# Altium project Segger J-Link Cortex Adapter Board.PrjPcb
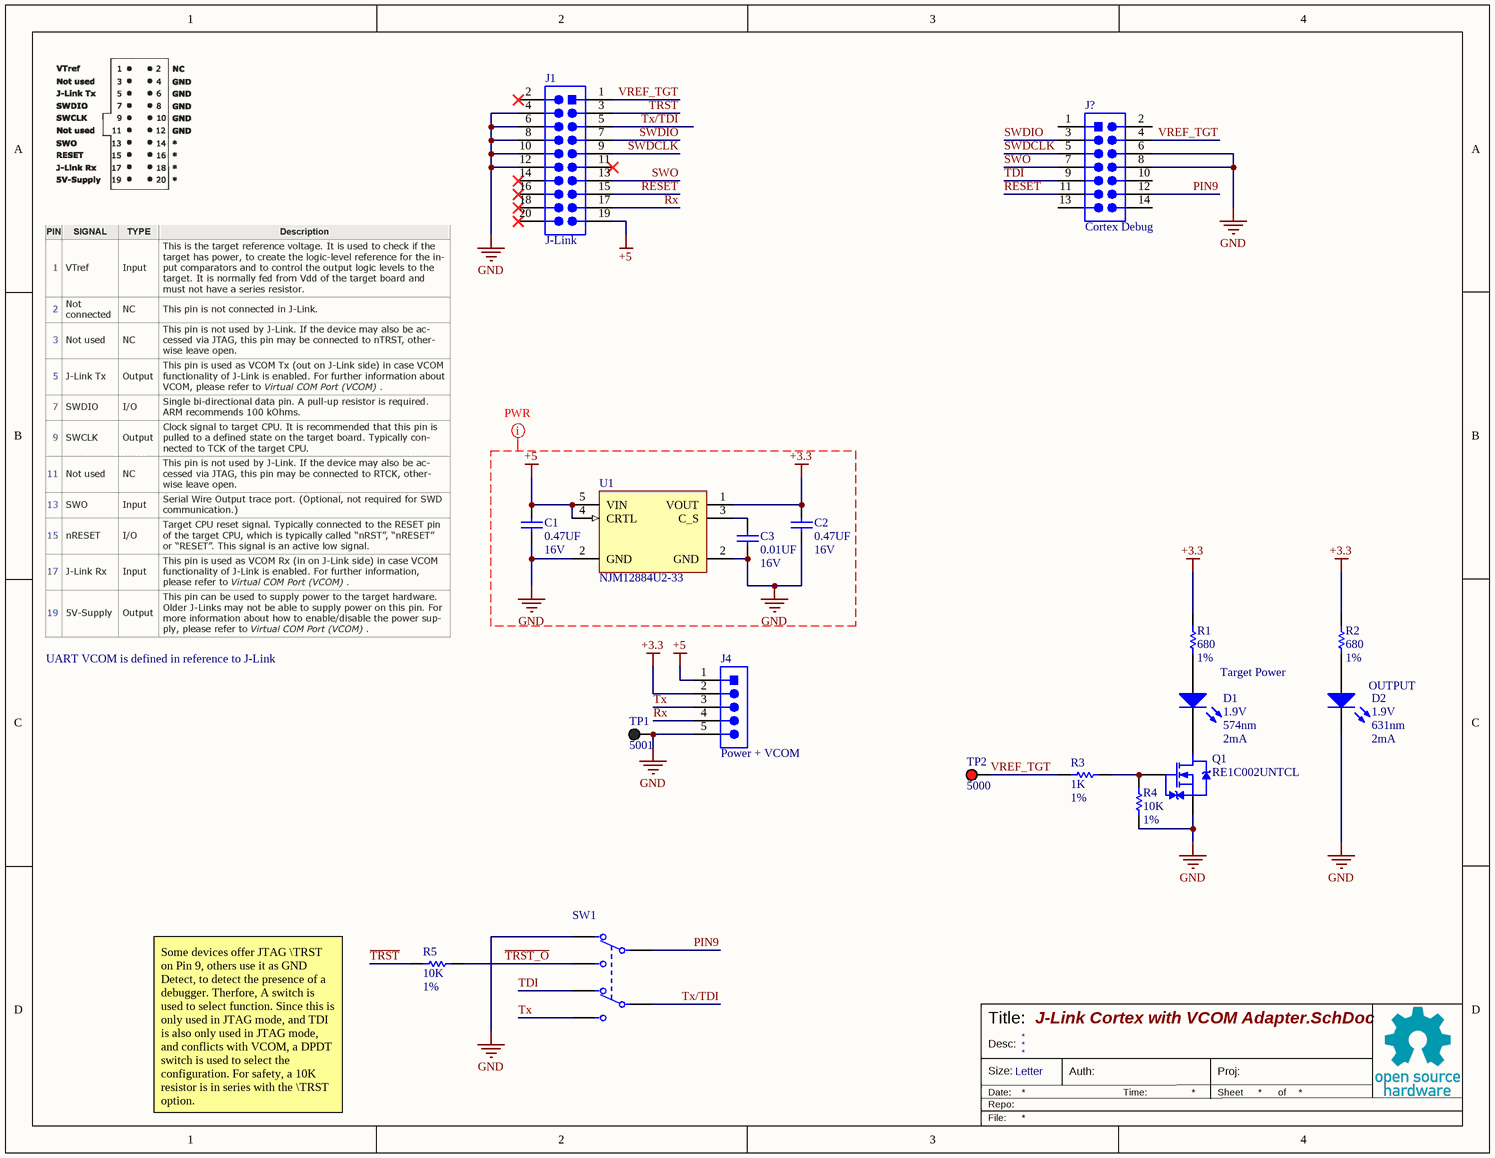
[diagram p0: J-Link Cortex with VCOM Adapter.SchDoc]
Version: v1.0; VerDate: 5/31/2020; ProjShrtName: J-Link Cortex + VCOM; ProjGitURL: https://github.com/aakatz3/J-Link-Cortex-VCOM; ProjAuth: Andrew Katz
1 sheet, 18 parts. Net scope: global (net labels, ports and power ports of the same name join across sheets).
Board file: J-Link Cortex with VCOM Adapter.PcbDoc

## Sheet J-Link Cortex with VCOM Adapter.SchDoc
size Letter; Engineer: Andrew Katz; Address4: USA; GithubURL: https://github.com/aakatz3/J-Link-Cortex-VCOM; ProjShort: J-Link Cortex + VCOM

### Parts
C1  Val: 0.47UF  Vol: 16V  [0603_CAP]  (hidden comment: CAP 0603 0.47UF 16V 10% X7R)
C2  Val: 0.47UF  Vol: 16V  [0603_CAP]  (hidden comment: CAP 0603 0.47UF 16V 10% X7R)
C3  Val: 0.01UF  Vol: 16V  [0603_CAP]  (hidden comment: CAP 0603 0.01UF 16V 10% X7R)
D1  Voltage Rating: 1.9V  Wavelength: 574nm  Test Current: 2mA  [SM0805GCL]  (hidden comment: Green LED)
D2  Voltage Rating: 1.9V  Wavelength: 631nm  Test Current: 2mA  [SM0805HCL]  (hidden comment: Red LED)
J1  20 contact Female header, RA  [SFH11-PBPC-D10-RA-BK]  (value not drawn)
J4  5 contacts Male header  [70543-0109 - slim]  (value not drawn)
J?  STDC14 Debug Connector  [FTSH-107-01-F-DV-K]  (value not drawn)
Q1  Manufacturer P/N: RE1C002UNTCL  [SC89]  (hidden comment: N-Channel MOSFET)
R1  Val: 680  Tol: 1%  [0603_RES]  (hidden comment: RES 0603 680 1%)
R2  Val: 680  Tol: 1%  [0603_RES]  (hidden comment: RES 0603 680 1%)
R3  Val: 1K  Tol: 1%  [0603_RES]  (hidden comment: RES 0603 1K 1%)
R4  Val: 10K  Tol: 1%  [0603_RES]  (hidden comment: RES 0603 10K 1%)
R5  Val: 10K  Tol: 1%  [0603_RES]  (hidden comment: RES 0603 10K 1%)
SW1  SWITCH SLIDE DPDT 300MA 6V  [JS202011CQN]  (value not drawn)
TP1  5001  [KSTN-5001]
TP2  5000  [KSTN-5000]
U1  P/N: NJM12884U2-33  [SOT89-5_NJR]  (hidden comment: 3.3V LDO Soft start reverse current reverse voltage)

### Nets
+3.3: C2.2 J4.2 R1.2 R2.2 U1.1(VOUT)
+5: C1.2 J1.19 J4.1 U1.4(CRTL) U1.5(VIN)
GND: C1.1 C2.1 C3.1 D2.K J1.4 J1.6 J1.8 J1.10 J1.12 J4.5 J?.6(SWDCLK/TCK) J?.8(SWO/TDO) Q1.2(S) R4.1 SW1.1 TP1.1 U1.2(GND)
~{RESET}: J1.15 J?.11(GNDDetect)
~{TRST}: J1.3 R5.1
~{TRST_O}: R5.2 SW1.3
PIN9: J?.12(~{RESET}) SW1.2
Rx: J1.17 J4.4
SWDCLK: J1.9 J?.5(GND)
SWDIO: J1.7 J?.3(VCC)
SWO: J1.13 J?.7(GND)
TDI: J?.9(RCLK) SW1.4
Tx: J4.3 SW1.6
Tx/TDI: J1.5 SW1.5
VREF_TGT: J1.1 J?.4(SWDIO/TMS) R3.1 TP2.1
NetC3_2: C3.2 U1.3(C_S)
NetD1_A: D1.A R1.1
NetD1_K: D1.K Q1.3(D)
NetD2_A: D2.A R2.1
NetQ1_1: Q1.1(G) R3.2 R4.2

Not connected (* = marked no-connect by the designer): J1 2* 11* 14* 16* 18* 20*; J? 1(Reserved) 2(Reserved) 10(NC/TDI) 13(TxD) 14(RxD)

### Layout directives
net class PWR: +3.3, +5, GND

### Notes on the sheet
- (near J?) Cortex Debug
- (near J1) J-Link
- UART VCOM is defined in reference to J-Link
- Target Power
- OUTPUT
- (near J4) Power + VCOM
- Some devices offer JTAG \TRST on Pin 9, others use it as GND Detect, to detect the presence of a debugger. Therfore, A switch is used to select function. Since this is only used in JTAG mode, and TDI is also only used in JTAG mode, and conflicts with VCOM, a DPDT switch is used to select the configuration. For safety, a 10K resistor is in series with the \TRST option.
- Title:
- Desc:
- Size:
- Date:
- File:
- Repo:
- Letter
- Auth:
- Time:
- Sheet
- Proj:
- of

### Library data of the parts
C1 C2 = CAP 0603 0.47UF 16V 10% X7R: Capacitor Surface Mount 0603 Footprint 0.47UF 16V 10% Tolerance Ceramic X7R; Manufacturer: Various; PCB Package: 0603; Description in Visual: Cap SMT 0603 0.47UF 16V 10%  Cer X7R; P/N: CAP 0603 0.47UF 16V 10% X7R; Manufacturer P/N: Various; Value: 0.47UF; Voltage: 16V; Tolerance: 10%; Type: Ceramic X7R; ComponentLink1Description: Manufacturer Website; ComponentLink2Description: Component Datasheet; ComponentLink3Description: Octopart Link
C3 = CAP 0603 0.01UF 16V 10% X7R: Capacitor Surface Mount 0603 Footprint 0.01UF 16V 10% Tolerance Ceramic X7R; Manufacturer: Various; PCB Package: 0603; Description in Visual: Cap SMT 0603 0.01UF 16V 10%  Cer X7R; P/N: CAP 0603 0.01UF 16V 10% X7R; Manufacturer P/N: Various; Value: 0.01UF; Voltage: 16V; Tolerance: 10%; Type: Ceramic X7R; ComponentLink1Description: Manufacturer Website; ComponentLink2Description: Component Datasheet; ComponentLink3Description: Octopart Link
D1 = SM0805GCL: Green 574nm LED Indication - Discrete 1.9V 0805 (2012 Metric); Manufacturer: Bivar; PCB Package: 0805; Configuration: Single; Lens Style: Square; Millicandela Rating: 3.6mcd; Viewing Angle: 130°; Lens Type: Clear; Package Class: Surface Mount; P/N: SM0805GCL; Manufacturer P/N: SM0805GCL; Description in Visual: Green 574nm LED Indication - Discrete 1.9V 0805 (2012 Metric); Color: Green; ComponentLink1Description: Manufacturer Website; ComponentLink1URL: #https://www.bivar.com/#; ComponentLink2Description: Component Datasheet; ComponentLink2URL: https://www.bivar.com/parts_content/Datasheets/SM0805HCL.pdf; ComponentLink3Description: Octopart Link; ComponentLink3URL: #https://octopart.com/sm0805gcl-bivar-22059573?r=sp#
D2 = SM0805HCL: Red 631nm LED Indication - Discrete 1.9V 0805 (2012 Metric); Manufacturer: Bivar; PCB Package: 0805; Configuration: Single; Lens Style: Square; Millicandela Rating: 11.5mcd; Viewing Angle: 130°; Lens Type: Clear; Package Class: Surface Mount; P/N: SM0805HCL; Manufacturer P/N: SM0805HCL; Description in Visual: Red 631nm LED Indication - Discrete 1.9V 0805 (2012 Metric); Color: Red; ComponentLink1Description: Manufacturer Website; ComponentLink1URL: #https://www.bivar.com/#; ComponentLink2Description: Component Datasheet; ComponentLink2URL: https://www.bivar.com/parts_content/Datasheets/SM0805HCL.pdf; ComponentLink3Description: Octopart Link; ComponentLink3URL: #https://octopart.com/sm0805hcl-bivar-2191581?r=sp#
J1 = SFH11-PBPC-D10-RA-BK: 20 Position Header Connector  Through Hole, Right Angle; Manufacturer: Sullins; PCB Package: 2x10 THT; Description in Visual: Con Hdr Female 20 contacts horizontal 2X10 keyed; Number of Contacts: 20; Pitch: 0.100"; P/N: SFH11-PBPC-D10-RA-BK; Manufacturer P/N: SFH11-PBPC-D10-RA-BK; Orientation: horizontal; Number of Rows: 2; ComponentLink1Description: Manufacturer Website; ComponentLink1URL: https://www.sullinscorp.com/; ComponentLink2Description: Component Datasheet; ComponentLink2URL: https://datasheet.ciiva.com/754/sfh11-pxxc-dxx-ra-xx11161-c-754566.pdf?src-supplier=Digi-Key; Supplier 1: Digi-Key; Supplier Part Number 1: S9205-ND
J4 = 70543-0109: Connector Male Header 1X5 vertical 5contacts 0.100in pitch 0.76um Gold finish shrouded with latch; Manufacturer: Molex; PCB Package: NON-STD TH; Description in Visual: Con Hdr Male 5contacts vertical 1X5; Number of Contacts: 5; P/N: 70543-0109; Manufacturer P/N: 70543-0109; Orientation: vertical; Number of Rows: 1.00; Pitch: 0.100in; Contact Finish: 0.76um Gold; Gender: Male; Options: shrouded with latch; ComponentLink1Description: Manufacturer Website; ComponentLink1URL: http://www.molex.com; ComponentLink2Description: Component Datasheet; ComponentLink2URL: http://www.molex.com/pdm_docs/sd/705430106_sd.pdf; ComponentLink4Description: Product Page; ComponentLink4URL: http://www.molex.com/molex/products/datasheet.jsp?part=active/0705430109_PCB_HEADERS.xml; ComponentLink3Description: Octopart Link; ComponentLink3URL: http://octopart.com/partsearch/#search/requestData&q=70543-0109; Supplier 1: Digi-Key; Supplier Part Number 1: WM4125-ND
J? = STDC14-Debug: STDC14 Debug Connector (ST Micro extension to the Cortex 10 Pin), 0.050" (1.27mm) Pitch; Manufacturer: Samtec; Number of Contacts: 14; Gender: Male; P/N: STDC14-Debug; Manufacturer P/N: FTSH-107-01-F-DV-K; Description in Visual: STDC14 Debug Connector (ST Micro extension to the Cortex 10 Pin), 0.050" (1.27mm) Pitch; Orientation: Vertical; Number of Rows: 2; Pitch: 0.050"; Contact Finish: Gold; ComponentLink1Description: Pinout Reference; ComponentLink1URL: https://www.st.com/resource/en/user_manual/dm00526767-stlinkv3set-debuggerprogrammer-for-stm8-and-stm32-stmicroelectronics.pdf; ComponentLink2Description: Datasheet for Connector; ComponentLink2URL: http://suddendocs.samtec.com/catalog_english/ftsh_smt.pdf; Supplier 3: Digi-Key; Supplier Part Number 3: FTSH-107-01-F-DV-K-P-ND; Supplier 1: Digi-Key; Supplier Part Number 1: SAM13170TR-ND; Supplier 2: Digi-Key; Supplier Part Number 2: 612-FTSH-107-01-F-DV-K-ND
Q1 = RE1C002UNTCL: N-Channel 20V 200mA (Ta) 150mW (Ta) Surface Mount EMT3F (SOT-416FL); Manufacturer: Rohm Semiconductor; Vdss (V): 20; RDSon (mOhms): 800; ID (Amps): 200; Rth(JC) (K/W): 833; P/N: RE1C002UNTCL; PCB Package: EMT3F; Description in Visual: N-Channel 20V 200mA (Ta) 150mW (Ta) Surface Mount EMT3F (SOT-416FL); Package Class: Surface Mount; ComponentLink1Description: Manufacturer Website; ComponentLink1URL: #http://www.rohm.com#; ComponentLink2Description: Component Datasheet; ComponentLink2URL: https://d1d2qsbl8m0m72.cloudfront.net/en/products/databook/datasheet/discrete/transistor/mosfet/re1c002untcl-e.pdf; ComponentLink4Description: SPICE Model; ComponentLink4URL: http://rohmfs.rohm.com/en/products/library/spice/discrete/transistor/mosfet/re1c002un.lib; ComponentLink3Description: Octopart Link; ComponentLink3URL: #https://octopart.com/re1c002untcl-rohm-30008399?r=sp#
R1 R2 = RES 0603 680 1%: Resistor Surface Mount, 680 Ohms, 0603 Footprint, 1% Tolerance 0.1W; Manufacturer: Various; PCB Package: 0603; Description in Visual: Res SMT 680 0603  1%  0.1W; Value: 680; P/N: RES 0603 680 1%; Manufacturer P/N: Various; Power_Rating: 0.1W; Tolerance: 1%; Supplier 1: Digi-Key; Supplier Part Number 1: 541-680HCT-ND; Supplier 2: Digi-Key; Supplier Part Number 2: 2019-RK73H1JTTD6800FCT-ND; Supplier 3: Digi-Key; Supplier Part Number 3: P680HCT-ND; Supplier 4: Digi-Key; Supplier Part Number 4: YAG3356CT-ND
R3 = RES 0603 1K 1%: Resistor Surface Mount, 1K Ohms, 0603 Footprint, 1% Tolerance 0.1W; Manufacturer: Various; PCB Package: 0603; Description in Visual: Res SMT 1K 0603  1%  0.1W; P/N: RES 0603 1K 1%; Manufacturer P/N: Various; Value: 1K; Power_Rating: 0.1W; Tolerance: 1%; Supplier 1: Digi-Key; Supplier Part Number 1: 2019-RK73H1JTTD1001FCT-ND; Supplier 2: Digi-Key; Supplier Part Number 2: 541-1166-1-ND; Supplier 3: RSComponents; Supplier Part Number 3: 1051155; Supplier 4: Digi-Key; Supplier Part Number 4: 311-1.00KHRCT-ND
R4 R5 = RES 0603 10K 1%: Resistor Surface Mount, 10K Ohms, 0603 Footprint, 1% Tolerance 0.1W; Manufacturer: Various; PCB Package: 0603; Description in Visual: Res SMT 10K 0603  1%  0.1W; P/N: RES 0603 10K 1%; Manufacturer P/N: Various; Value: 10K; Power_Rating: 0.1W; Tolerance: 1%; Supplier 1: Digi-Key; Supplier Part Number 1: P10.0KHCT-ND; Supplier 2: Digi-Key; Supplier Part Number 2: 541-10.0KHCT-ND; Supplier 3: Newark; Supplier Part Number 3: 68R0128; Supplier 4: Digi-Key; Supplier Part Number 4: A106048CT-ND
SW1 = JS202011CQN: Slide Switch DPDT Through Hole; Manufacturer: C&K; Number of Switches: 1; Rated Voltage (V): 6VDC; Electrical Life: 5000 Cycles; Switch Function: On-On; Actuator Height: 2.0mm; P/N: JS202011CQN; Manufacturer Part Number: JS202011CQN; Type: Slide; Rated Current (A): 300mA; Temperature Range: -40°C ~ 85°C; Mounting Style: Through Hole; Throw Configuration: DPDT; Supplier 1: Digi-Key; Supplier Part Number 1: 401-2001-ND
TP1 = 5001: Test Point, Black, 1-Pin THD, RoHS, Bulk; Manufacturer: KeystoneElectronics; Outside Diameter: 2.54mm; Plating: Silver; Mounting Hole Size: 1mm; Product: TestPoints; Packaging: Bulk; Manufacturer URL: http://www.keyelco.com/; Length: 7.62mm; Datasheet Version: Rev. G, 12/2008; Type: Miniature; Product Category: CircuitBoardHardware-PCB; Material: Nylon; RoHS: True; Contact Material: PhosphorBronze; Datasheet URL: https://ciiva.com/datasheet-click-2917627?src=ciiva&sig=bd195616; Color: Black; Brand: KeystoneElectronics; Supplier 1: Digi-Key; Supplier Part Number 1: 36-5001-ND
TP2 = 5000: Test Point, Red, 1-Pin THD, RoHS, Bulk; Manufacturer: KeystoneElectronics; Outside Diameter: 2.54mm; Plating: Silver; Mounting Hole Size: 1mm; Product: TestPoints; Packaging: Bulk; Manufacturer URL: http://www.keyelco.com/; Length: 7.62mm; Datasheet Version: Rev. G, 12/2008; Type: Miniature; Product Category: CircuitBoardHardware-PCB; Material: Nylon; RoHS: True; Contact Material: PhosphorBronze; Datasheet URL: https://ciiva.com/datasheet-click-2917627?src=ciiva&sig=bd195616; Color: Red; Brand: KeystoneElectronics; Supplier 1: Digi-Key; Supplier Part Number 1: 36-5000-ND
U1 = NJM12884U2-33: Linear Voltage Regulator IC  1 Output  500mA SOT-89-5; Manufacturer: NJR Corporation/NJRC; Manufacturer P/N: NJM12884U2-33-TE1; Vin Min (Volts): 3.48; Vin Max (Volts): 6.5; Quiescent Current (mA): 0.280; Initial Error: ±1%; PCB Package: SOT89-5-2; Layout Considerations: Schottky barrier diode is not needed; CIN ≥ 0.33μF; COUT ≥ 0.47μF; Description in Visual: Linear Voltage Regulator IC  1 Output  500mA SOT-89-5; Type: LDO; Features: Control, Soft-start, Discharge, Thermal Shutdown, Over-current, Reverse current; Output Voltage (Volts): 3.3V; Temperature Range: -40°C - 125°C; ComponentLink1Description: Manufacturer's Website; ComponentLink2Description: Component Datasheet; ComponentLink2URL: https://www.njr.com/semicon/PDF/NJM12884_E.pdf; ComponentLink3Description: Octopart Link; ComponentLink3URL: #https://octopart.com/njm12884u2-33-te1-new+japan+radio-92406224?r=sp#; Supplier 1: Digi-Key; Supplier Part Number 1: 190-NJM12884U2-33-TE1CT-ND